# EAGLE design logger_shield (EAGLE 5.09)
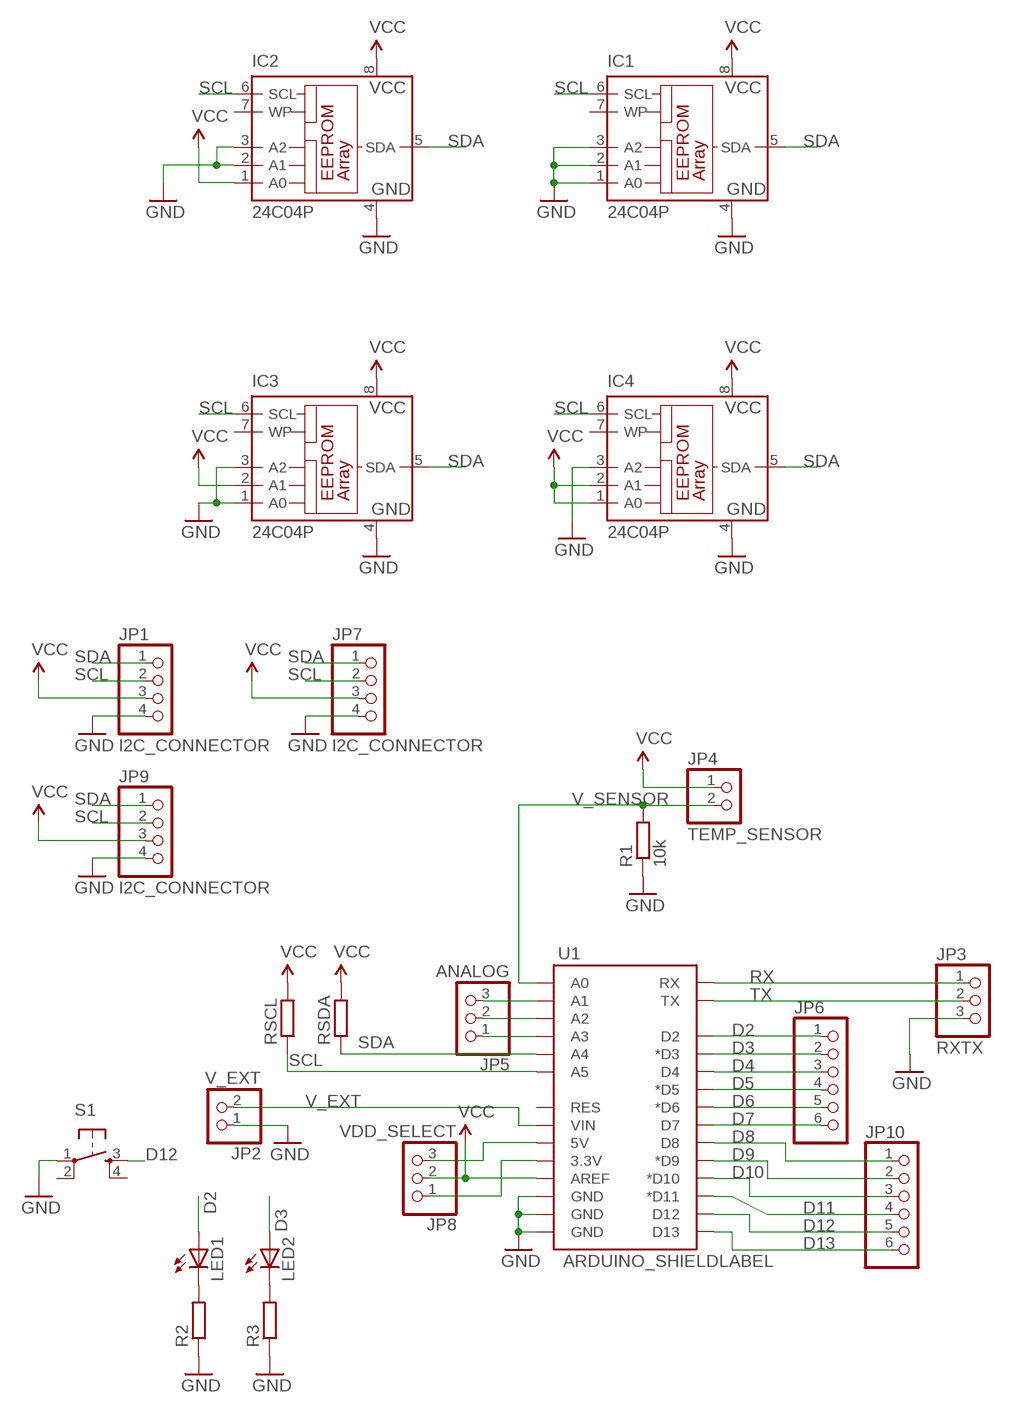
[diagram p0: schematic, sheet 1]

## Parts
IC1  24C04P  [DIL8]
IC2  24C04P  [DIL8]
IC3  24C04P  [DIL8]
IC4  24C04P  [DIL8]
JP1  I2C_CONNECTOR  PINHD-1X4  [1X04]
JP2  V_EXT  PINHD-1X2  [1X02]
JP3  RXTX  PINHD-1X3  [1X03]
JP4  TEMP_SENSOR  PINHD-1X2  [1X02]
JP5  ANALOG  PINHD-1X3  [1X03]
JP6  PINHD-1X6  [1X06]
JP7  I2C_CONNECTOR  PINHD-1X4  [1X04]
JP8  VDD_SELECT  PINHD-1X3  [1X03]
JP9  I2C_CONNECTOR  PINHD-1X4  [1X04]
JP10  PINHD-1X6  [1X06]
LED1  LED3MM  [LED3MM]
LED2  LED3MM  [LED3MM]
R1  10k  R-EU_0207/12  [0207/12]
R2  R-EU_0207/7  [0207/7]
R3  R-EU_0207/7  [0207/7]
RSCL  R-EU_0207/12  [0207/12]
RSDA  R-EU_0207/12  [0207/12]
S1  TAC_SWITCHPTH  [TACTILE-PTH]
U1  ARDUINO_SHIELDLABEL  [DUEMILANOVE_SHIELD]

## Nets
D2: JP6.1 LED1.A U1.D2
D3: JP6.2 LED2.A U1.D3(*D3)
D4: JP6.3 U1.D4
D5: JP6.4 U1.D5(*D5)
D6: JP6.5 U1.D6(*D6)
D7: JP6.6 U1.D7
D8: JP10.1 U1.D8
D9: JP10.2 U1.D9(*D9)
D10: JP10.3 U1.D10(*D10)
D11: JP10.4 U1.D11(*D11)
D12: JP10.5 S1.3 U1.D12
D13: JP10.6 U1.D13
GND: IC1.1(A0) IC1.2(A1) IC1.3(A2) IC1.4(GND) IC2.2(A1) IC2.3(A2) IC2.4(GND) IC3.1(A0) IC3.3(A2) IC3.4(GND) IC4.3(A2) IC4.4(GND) JP1.4 JP2.1 JP3.3 JP7.4 JP9.4 R1.1 R2.1 R3.1 S1.1 U1.GND@0(GND) U1.GND@1(GND) U1.GND@2(GND)
N$13: LED1.K(C) R2.2
N$15: LED2.K(C) R3.2
N$20: JP5.3 U1.A1
N$21: JP5.2 U1.A2
N$22: JP5.1 U1.A3
RX: JP3.1 U1.RX
SCL: IC1.6(SCL) IC2.6(SCL) IC3.6(SCL) IC4.6(SCL) JP1.2 JP7.2 JP9.2 RSCL.1 U1.A5
SDA: IC1.5(SDA) IC2.5(SDA) IC3.5(SDA) IC4.5(SDA) JP1.1 JP7.1 JP9.1 RSDA.1 U1.A4
TX: JP3.2 U1.TX
V_EXT: JP2.2 U1.VIN
V_SENSOR: JP4.2 R1.2 U1.A0
VCC: IC1.8(VCC) IC2.1(A0) IC2.8(VCC) IC3.2(A1) IC3.8(VCC) IC4.1(A0) IC4.2(A1) IC4.8(VCC) JP1.3 JP4.1 JP7.3 JP8.2 JP9.3 RSCL.2 RSDA.2 U1.AREF
VDD5: JP8.3 U1.5V
VDD33: JP8.1 U1.3.3V
Unconnected: IC1.7(WP) IC2.7(WP) IC3.7(WP) IC4.7(WP) S1.2 S1.4 U1.RES

## Library data of the parts
IC1-IC4 = microchip:24C*: Serial EEPROM 1 K/2 K/4 K
JP1 JP7 JP9 = pinhead:PINHD-1X4: PIN HEADER
JP2 JP4 = pinhead:PINHD-1X2: PIN HEADER
JP3 JP5 JP8 = pinhead:PINHD-1X3: PIN HEADER
JP6 JP10 = pinhead:PINHD-1X6: PIN HEADER
LED1 LED2 = led:LED: LED OSRAM: - CHIPLED LG R971, LG N971, LY N971, LG Q971, LY Q971, LO R971, LY R971 LH N974, LH R974 LS Q976, LO Q976, LY Q976 LO Q996 - Hyper CHIPLED LW Q18S LB Q993, LB Q99A, LB R99A - SideLED LS A670, LO A670, LY A670, LG A670, LP A670 LB A673, LV A673, LT A673, LW A673 LH A674 LY A675 LS A676, LA A676, LO A676, LY A676, LW A676 LS A679, LY A679, LG A679 - Hyper Micro SIDELED® LS Y876, LA Y876, LO Y876, LY Y876 LT Y87S - SmartLED LW L88C, LW L88S LB L89C, LB L89S, LG L890 LS L89K, LO L89K, LY L89K LS L896, LA L896, LO L896, LY L896 - TOPLED LS T670, LO T670, LY T670, LG T670, LP T670 LSG T670, LSP T670, LSY T670, LOP T670, LYG T670 LG T671, LOG T671, LSG T671 LB T673, LV T673, LT T673, LW T673 LH T674 LS T676, LA T676, LO T676, LY T676, LB T676, LH T676, LSB T676, LW T676 LB T67C, LV T67C, LT T67C, LS T67K, LO T67K, LY T67K, LW E67C LS E67B, LA E67B, LO E67B, LY E67B, LB E67C, LV E67C, LT E67C LW T67C LS T679, LY T679, LG T679 LS T770, LO T770, LY T770, LG T770, LP T770 LB T773, LV T773, LT T773, LW T773 LH T774 LS E675, LA E675, LY E675, LS T675 LS T776, LA T776, LO T776, LY T776, LB T776 LHGB T686 LT T68C, LB T68C - Hyper Mini TOPLED® LB M676 - Mini TOPLED Santana® LG M470 LS M47K, LO M47K, LY M47K Source: http://www.osram.convergy.de LUXEON: - LUMILED® LXK2-PW12-R00, LXK2-PW12-S00, LXK2-PW14-U00, LXK2-PW14-V00 LXK2-PM12-R00, LXK2-PM12-S00, LXK2-PM14-U00 LXK2-PE12-Q00, LXK2-PE12-R00, LXK2-PE12-S00, LXK2-PE14-T00, LXK2-PE14-U00 LXK2-PB12-K00, LXK2-PB12-L00, LXK2-PB12-M00, LXK2-PB14-N00, LXK2-PB14-P00, LXK2-PB14-Q00 LXK2-PR12-L00, LXK2-PR12-M00, LXK2-PR14-Q00, LXK2-PR14-R00 LXK2-PD12-Q00, LXK2-PD12-R00, LXK2-PD12-S00 LXK2-PH12-R00, LXK2-PH12-S00 LXK2-PL12-P00, LXK2-PL12-Q00, LXK2-PL12-R00 Source: www.luxeon.com KINGBRIGHT: KA-3528ASYC Source: www.kingbright.com
R1 RSCL RSDA = rcl:R-EU_: RESISTOR, European symbol
R2 R3 = resistor:R-EU_: RESISTOR, European symbol
S1 = SparkFun:TAC_SWITCH: Momentary Switch Button commonly used for reset or general input. Spark Fun Electronics SKU : COM-00097
U1 = SparkFun:ARDUINO_SHIELD

## Board
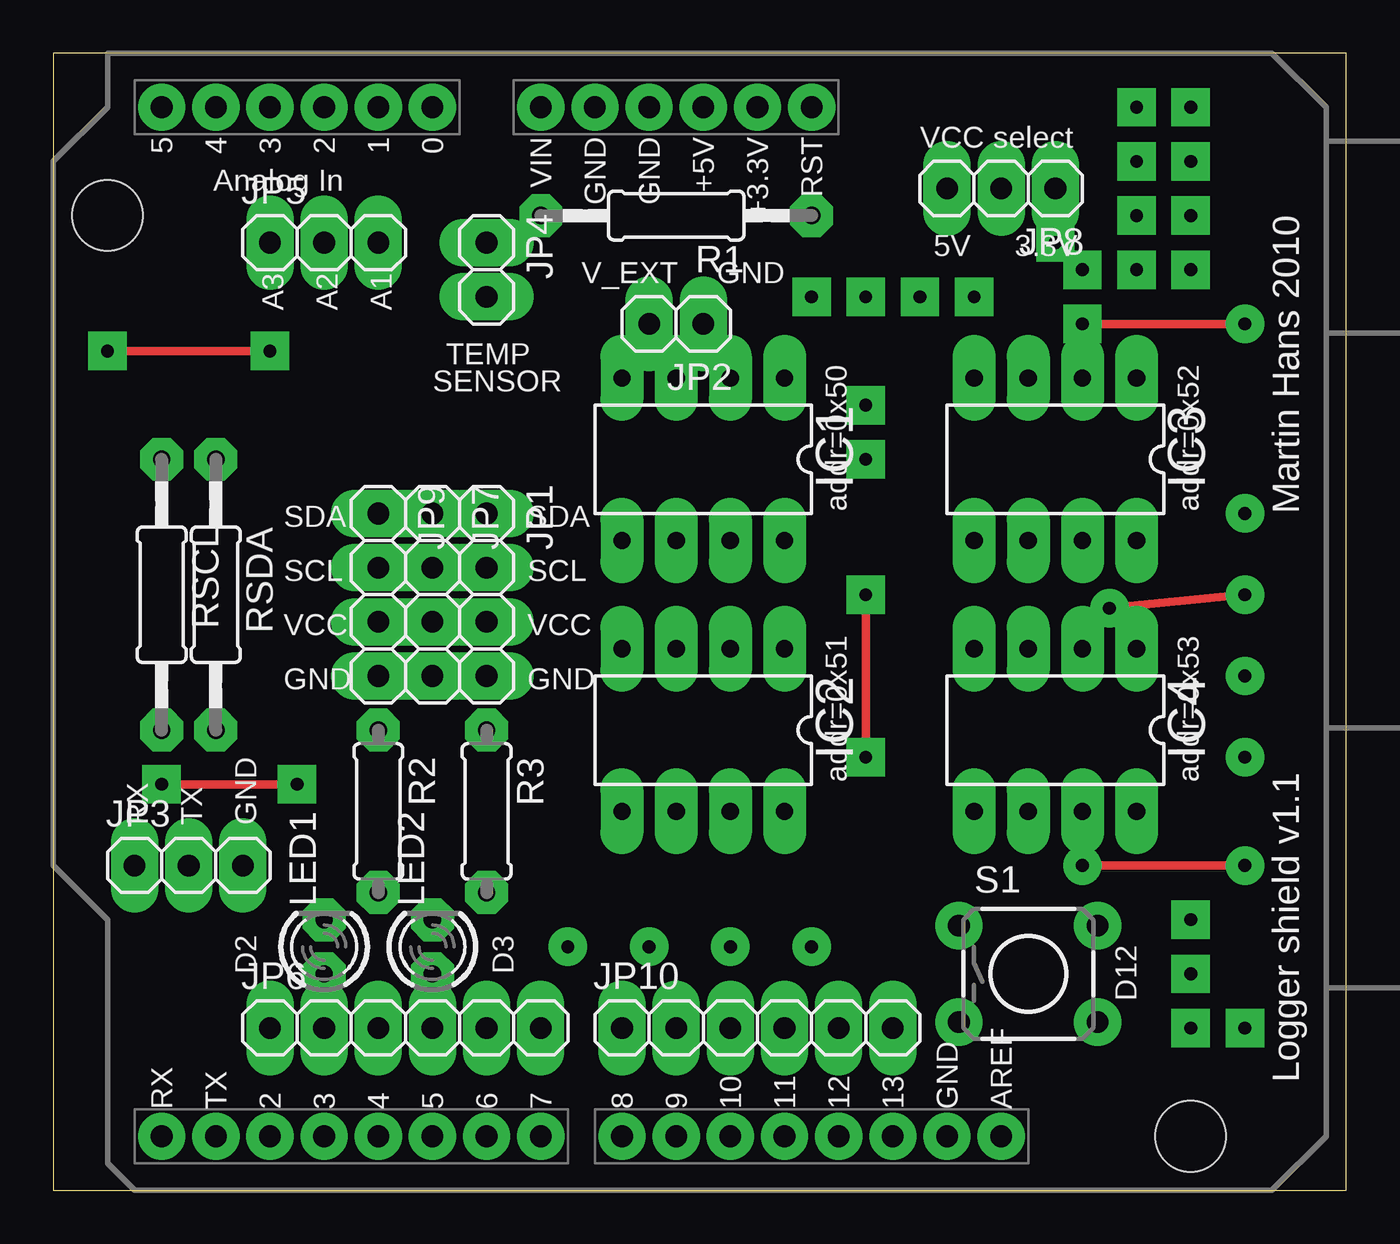
[diagram p1: board, top side]
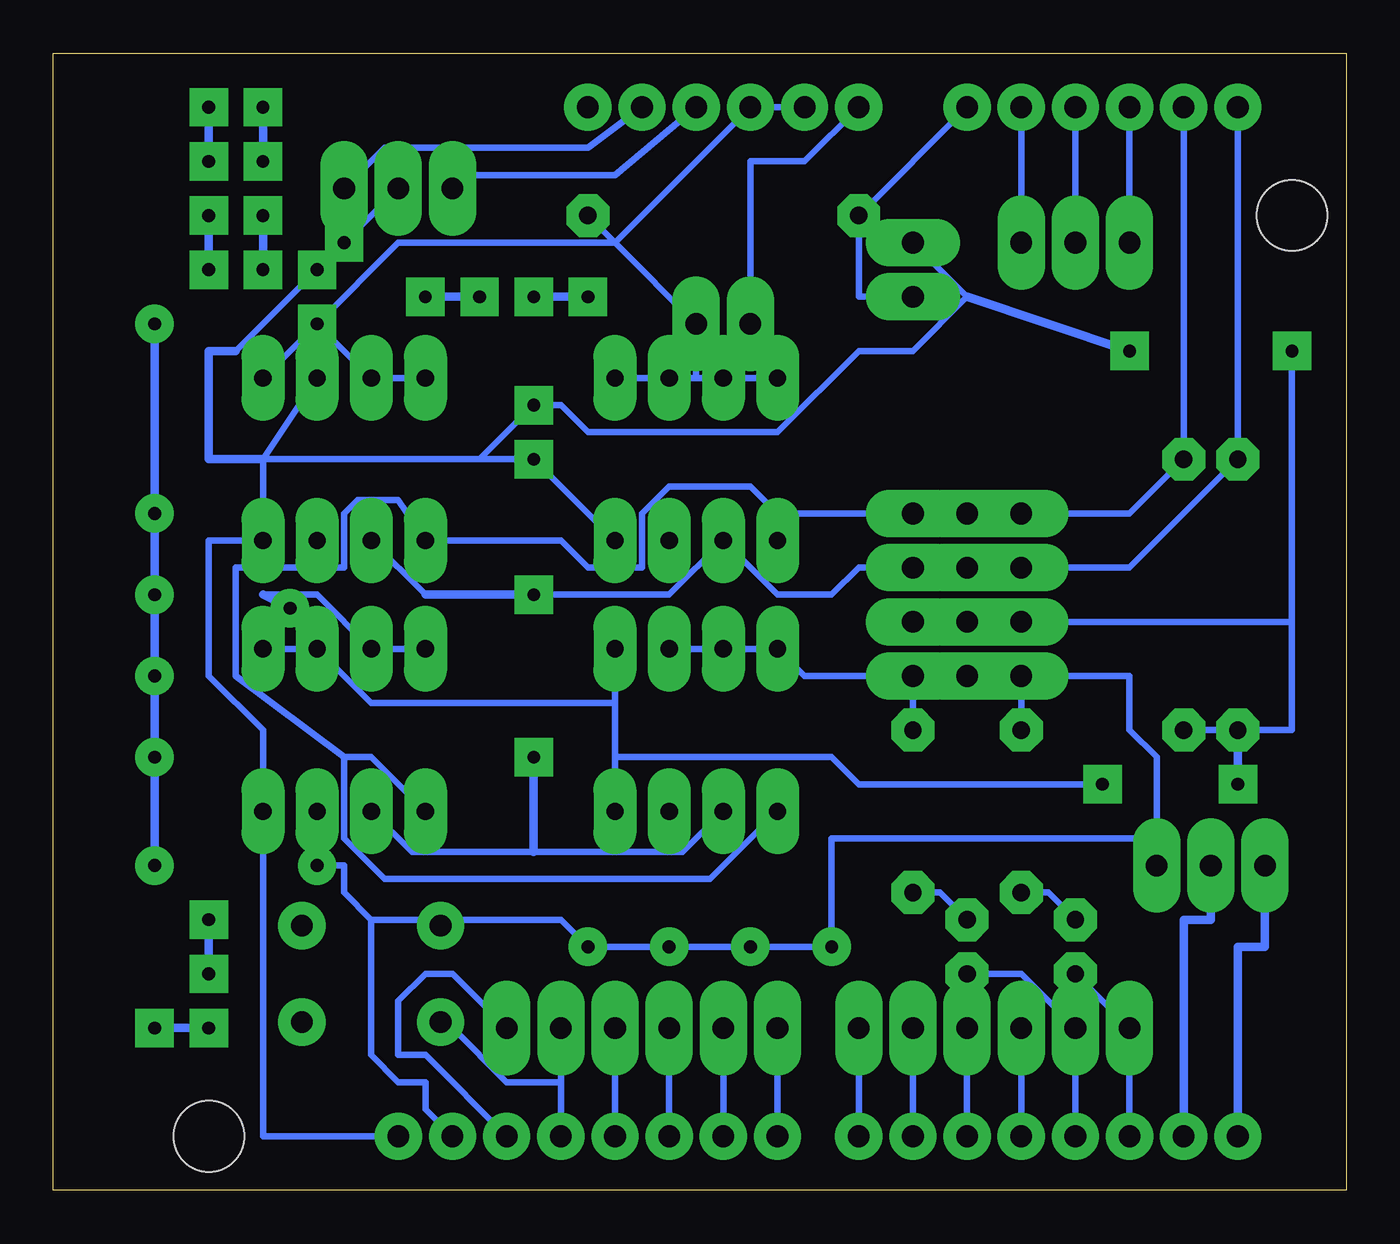
[diagram p2: board, bottom side, seen from below]

Size 60.63 x 53.33 mm. Coordinates in mm from the lower left corner, seen from the top.
Outline: 0,0 60.63,0 60.63,53.33 0,53.33 0,0
Copper layers (1*16): Top 0.035mm / dielectric 1.5mm / Bottom 0.035mm
Design rules "toner_transfer *": minimum track width 0.3mm, minimum drill 0.3mm, track to track 0.4mm, track to pad 0.35mm, pad to pad 0.45mm, via to via 0.3mm, smd to smd 8mil, copper to edge 10mil, drill to drill 8mil, minimum pad ring 0.6mm, minimum via ring 0.6mm, stop-mask expansion 0mil, vias tented up to drill 0mil, thermal gap 10mil

### Footprints (pad centres in the part's own frame; a part is rotated, then mirrored left to right if it is on the bottom)
DIL8 = drill 0.813 long: 1 -3.81,-3.81; 2 -1.27,-3.81; 3 1.27,-3.81; 4 3.81,-3.81; 5 3.81,3.81; 6 1.27,3.81; 7 -1.27,3.81; 8 -3.81,3.81
1X04 = drill 1.016 long: 1 -3.81,0; 2 -1.27,0; 3 1.27,0; 4 3.81,0
1X02 = drill 1.016 long: 1 -1.27,0; 2 1.27,0
1X03 = drill 1.016 long: 1 -2.54,0; 2 0,0; 3 2.54,0
1X06 = drill 1.016 long: 1 -6.35,0; 2 -3.81,0; 3 -1.27,0; 4 1.27,0; 5 3.81,0; 6 6.35,0
LED3MM = drill 0.813 octagon: A -1.27,0; K 1.27,0
0207/12 = drill 0.813 octagon: 1 -6.35,0; 2 6.35,0
0207/7 = drill 0.813 octagon: 1 -3.81,0; 2 3.81,0
TACTILE-PTH = drill 1.016 pad 1.88 round: 1 -3.251,2.261; 2 3.251,2.261; 3 -3.251,-2.261; 4 3.251,-2.261
DUEMILANOVE_SHIELD = drill 1.016 pad 1.88 round: 3.3V 50.8,26.67; 5V 50.8,29.21; A0 50.8,41.91; A1 50.8,44.45; A2 50.8,46.99; A3 50.8,49.53; A4 50.8,52.07; A5 50.8,54.61; AREF 2.54,15.24; D2 2.54,49.53; D3 2.54,46.99; D4 2.54,44.45; D5 2.54,41.91; D6 2.54,39.37; D7 2.54,36.83; D8 2.54,33.02; D9 2.54,30.48; D10 2.54,27.94; D11 2.54,25.4; D12 2.54,22.86; D13 2.54,20.32; GND@0 50.8,31.75; GND@1 50.8,34.29; GND@2 2.54,17.78; RES 50.8,24.13; RX 2.54,54.61; TX 2.54,52.07; VIN 50.8,36.83 | hole 3.302: 45.72,57.15; 2.54,6.35

### Placement (x,y rotation side)
DRILEGEND  [DRILEGEND]  -0.15,-4.83 0 top  (outside the outline)
IC1  30.48,34.29 180 top
IC2  30.48,21.59 180 top
IC3  46.99,34.29 180 top
IC4  46.99,21.59 180 top
JP1  20.32,27.94 270 top
JP2  29.21,40.64 180 top
JP3  6.35,15.24 0 top
JP4  20.32,43.18 270 top
JP5  12.7,44.45 0 top
JP6  16.51,7.62 0 top
JP7  17.78,27.94 270 top
JP8  44.45,46.99 180 top
JP9  15.24,27.94 270 top
JP10  33.02,7.62 0 top
LED1  12.7,11.43 90 top
LED2  17.78,11.43 90 top
R1  29.21,45.72 180 top
R2  15.24,17.78 270 top
R3  20.32,17.78 270 top
RSCL  5.08,27.94 270 top
RSDA  7.62,27.94 270 top
S1  45.72,10.16 0 top
U1  59.69,0 90 top

### Tracks (layer width: path | path; a pad name or v marks a point on that pad's centre or on a via)
D2
  Bottom 0.3: LED1.A JP6.1 U1.D2
D3
  Bottom 0.3: LED2.A 15.24,10.16 JP6.2 U1.D3
D4
  Bottom 0.3: U1.D4 JP6.3
D5
  Bottom 0.3: U1.D5 JP6.4
D6
  Bottom 0.3: U1.D6 JP6.5
D7
  Bottom 0.3: U1.D7 JP6.6
D8
  Bottom 0.3: U1.D8 JP10.1
D9
  Bottom 0.3: U1.D9 JP10.2
D10
  Bottom 0.3: U1.D10 JP10.3
D11
  Bottom 0.3: U1.D11 JP10.4
D12
  Bottom 0.3: U1.D12 36.83,5.08 | 36.83,5.08 JP10.5 | 36.83,5.08 39.37,5.08 41.91,7.62 S1.3
D13
  Bottom 0.3: JP10.6 41.91,10.16 43.18,10.16 44.45,8.89 44.45,6.35 43.18,6.35 U1.D13
GND  (via drill 0.6)
  Top 0.406: v48.26,15.24 v55.88,15.24 | v55.88,40.64 v48.26,40.64 | v55.88,27.94 v49.53,27.3
  Bottom 0.3: JP3.3 8.89,16.51 | 8.89,16.51 8.89,20.32 10.16,21.59 10.16,24.13 JP9.4 | 50.8,27.94 48.26,27.94 IC4.3 IC4.4 | JP9.4 JP7.4 JP1.4 | JP1.4 25.4,24.13 IC2.4 IC2.3 IC2.2 | IC1.4 IC1.3 30.48,38.1 | 30.48,38.1 IC1.2 IC1.1 | IC3.4 IC3.3 v48.26,40.64 | 34.29,44.45 JP2.1 30.48,38.1 | 34.29,44.45 R1.1 | v48.26,40.64 44.45,44.45 34.29,44.45 | v48.26,40.64 IC3.1 | 34.29,44.45 U1.GND@0 U1.GND@1 | JP9.4 R2.1 | JP1.4 R3.1 | 8.89,16.51 24.13,16.51 v24.13,11.43 v27.94,11.43 v31.75,11.43 v35.56,11.43 36.83,12.7 41.91,12.7 S1.1 43.18,12.7 45.72,12.7 | U1.GND@2 43.18,3.81 43.18,5.08 44.45,5.08 45.72,6.35 45.72,12.7 | 45.72,12.7 46.99,13.97 46.99,15.24 v48.26,15.24
  Bottom 0.406: v55.88,15.24 v55.88,20.32 v55.88,24.13 v55.88,27.94 v55.88,31.75 v55.88,40.64 | v49.53,27.3 50.8,27.94
N$3  (via drill 0.6)
  Bottom 0.406: v50.8,48.26 v50.8,50.8
N$4  (via drill 0.6)
  Bottom 0.406: v53.34,48.26 v53.34,50.8
N$5  (via drill 0.6)
  Bottom 0.406: v50.8,43.18 v50.8,45.72
N$6  (via drill 0.6)
  Bottom 0.406: v53.34,43.18 v53.34,45.72
N$7  (via drill 0.6)
  Bottom 0.406: v35.56,41.91 v38.1,41.91
N$9  (via drill 0.6)
  Bottom 0.406: v40.64,41.91 v43.18,41.91
N$12  (via drill 0.6)
  Bottom 0.406: v53.34,7.62 v55.88,7.62
N$13
  Bottom 0.3: LED1.K 13.97,13.97 R2.2
N$14  (via drill 0.6)
  Bottom 0.406: v53.34,10.16 v53.34,12.7
N$15
  Bottom 0.3: LED2.K 19.05,13.97 R3.2
N$20
  Bottom 0.3: JP5.3 U1.A1
N$21
  Bottom 0.3: JP5.2 U1.A2
N$22
  Bottom 0.3: JP5.1 U1.A3
RX
  Bottom 0.406: U1.RX 5.08,11.43 3.81,11.43 JP3.1
SCL  (via drill 0.6)
  Top 0.406: v38.1,27.94 v38.1,20.32
  Bottom 0.3: IC2.6 31.11,15.88 38.1,15.88 43.81,15.88 IC4.6 | 43.18,27.94 IC3.6 | v38.1,27.94 31.75,27.94 IC1.6 26.67,27.94 24.13,27.94 22.86,29.21 JP1.2 JP7.2 JP9.2 10.16,29.21 RSCL.1 U1.A5
  Bottom 0.406: v38.1,27.94 43.18,27.94 | v38.1,20.32 38.1,15.88
SDA
  Bottom 0.3: U1.A4 RSDA.1 10.16,31.75 JP9.1 JP7.1 JP1.1 26.67,31.75 | IC2.5 29.84,14.61 45.09,14.61 46.99,16.51 46.99,20.32 | 46.99,20.32 45.72,20.32 IC4.5 | 26.67,31.75 IC1.5 | 26.67,31.75 27.94,33.02 31.75,33.02 33.02,31.75 33.02,29.21 35.56,29.21 36.83,30.48 IC3.5 44.45,32.38 46.35,32.38 46.99,31.75 46.99,29.21 52.07,29.21 52.07,24.13 46.99,20.32
TX
  Bottom 0.406: U1.TX 7.62,12.7 6.35,12.7 JP3.2
V_EXT
  Bottom 0.3: JP2.2 27.94,48.26 25.4,48.26 U1.VIN
V_SENSOR
  Bottom 0.3: JP4.2 22.86,41.91 R1.2 U1.A0
VCC  (via drill 0.6)
  Top 0.406: v2.54,39.37 v10.16,39.37 | v5.08,19.05 v11.43,19.05
  Bottom 0.3: RSDA.2 RSCL.2 2.54,21.59 2.54,26.67 | JP4.1 17.78,41.91 20.32,39.37 22.86,39.37 26.67,35.56 35.56,35.56 36.83,36.83 v38.1,36.83 40.64,34.29 | 2.54,26.67 v2.54,39.37 | 34.29,20.32 34.29,22.86 | 34.29,22.86 45.72,22.86 IC4.2 IC4.1 | U1.AREF 50.8,2.54 IC4.8 50.8,21.59 53.34,24.13 53.34,30.48 IC3.8 50.8,34.29 | JP1.3 JP7.3 JP9.3 2.54,26.67 | 40.64,34.29 v38.1,34.29 IC1.8 | 40.64,34.29 50.8,34.29 | 50.8,34.29 IC3.2 | 52.07,39.37 v48.26,43.18 v46.99,44.45 JP8.2 | v11.43,19.05 22.86,19.05 24.13,20.32 34.29,20.32 | 34.29,20.32 IC2.8 | 34.29,22.86 IC2.1
  Bottom 0.406: v10.16,39.37 17.78,41.91 | v5.08,19.05 RSCL.2 | 52.07,39.37 53.34,39.37 53.34,34.29 50.8,34.29
VDD5
  Bottom 0.3: JP8.3 41.27,47.62 34.29,47.62 U1.5V
VDD33
  Bottom 0.3: JP8.1 45.09,48.9 35.56,48.9 U1.3.3V

### Text on the board
tPlace: VCC select | 5V | 3.3V | V_EXT | GND | A3 | A2 | A1 | TEMP | addr=0x50 | addr=0x52 | SENSOR | Martin Hans 2010 | SDA | SDA | SCL | SCL | VCC | VCC | addr=0x51 | addr=0x53 | GND | GND | RX | TX | GND | D2 | D3 | D12 | Logger shield v1.1